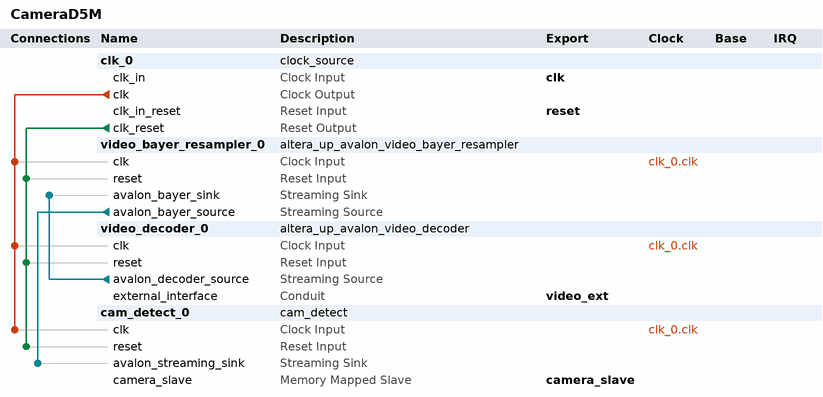
[diagram p0: system contents]
# Platform Designer (Qsys) system CameraD5M, Cyclone IV E EP4CE115F29C7
# Parameters at their usual value, and those the tool derives, are not listed.
package require -exact qsys 16.1
create_system CameraD5M
set_project_property DEVICE_FAMILY {Cyclone IV E}
set_project_property DEVICE EP4CE115F29C7

add_instance clk_0 clock_source 16.1
set_instance_parameter_value clk_0 clockFrequency 50000000

add_instance video_bayer_resampler_0 altera_up_avalon_video_bayer_resampler 16.1
set_instance_parameter_value video_bayer_resampler_0 custom_height_in 1944
set_instance_parameter_value video_bayer_resampler_0 custom_width_in 2592
set_instance_parameter_value video_bayer_resampler_0 use_custom_format true

add_instance video_decoder_0 altera_up_avalon_video_decoder 16.1
set_instance_parameter_value video_decoder_0 video_source {5MP Daughtercard (THDB_D5M)}

add_instance cam_detect_0 cam_detect 1.0

# connections
add_connection clk_0.clk cam_detect_0.clk clock
add_connection clk_0.clk video_bayer_resampler_0.clk clock
add_connection clk_0.clk video_decoder_0.clk clock
add_connection clk_0.clk_reset cam_detect_0.reset reset
add_connection clk_0.clk_reset video_bayer_resampler_0.reset reset
add_connection clk_0.clk_reset video_decoder_0.reset reset
add_connection video_bayer_resampler_0.avalon_bayer_source cam_detect_0.avalon_streaming_sink avalon_streaming
add_connection video_decoder_0.avalon_decoder_source video_bayer_resampler_0.avalon_bayer_sink avalon_streaming

# exported interfaces
add_interface camera_slave avalon slave
set_interface_property camera_slave EXPORT_OF cam_detect_0.camera_slave
add_interface clk clock sink
set_interface_property clk EXPORT_OF clk_0.clk_in
add_interface reset reset sink
set_interface_property reset EXPORT_OF clk_0.clk_in_reset
add_interface video_ext conduit end
set_interface_property video_ext EXPORT_OF video_decoder_0.external_interface

set_interconnect_requirement {$system} qsys_mm.clockCrossingAdapter HANDSHAKE
set_interconnect_requirement {$system} qsys_mm.enableEccProtection FALSE
set_interconnect_requirement {$system} qsys_mm.insertDefaultSlave FALSE
set_interconnect_requirement {$system} qsys_mm.maxAdditionalLatency 1

save_system CameraD5M.qsys
